# EasyEDA Pro project MSDRv2.eprj, board PCB11
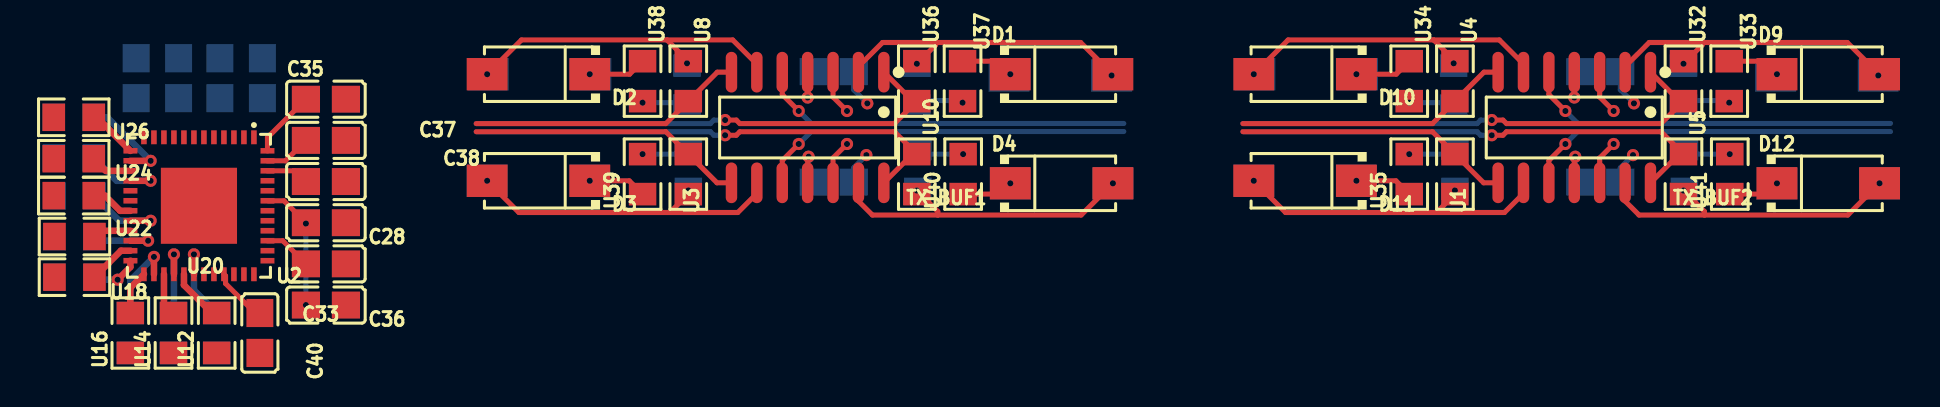
[diagram p16: board, top side]
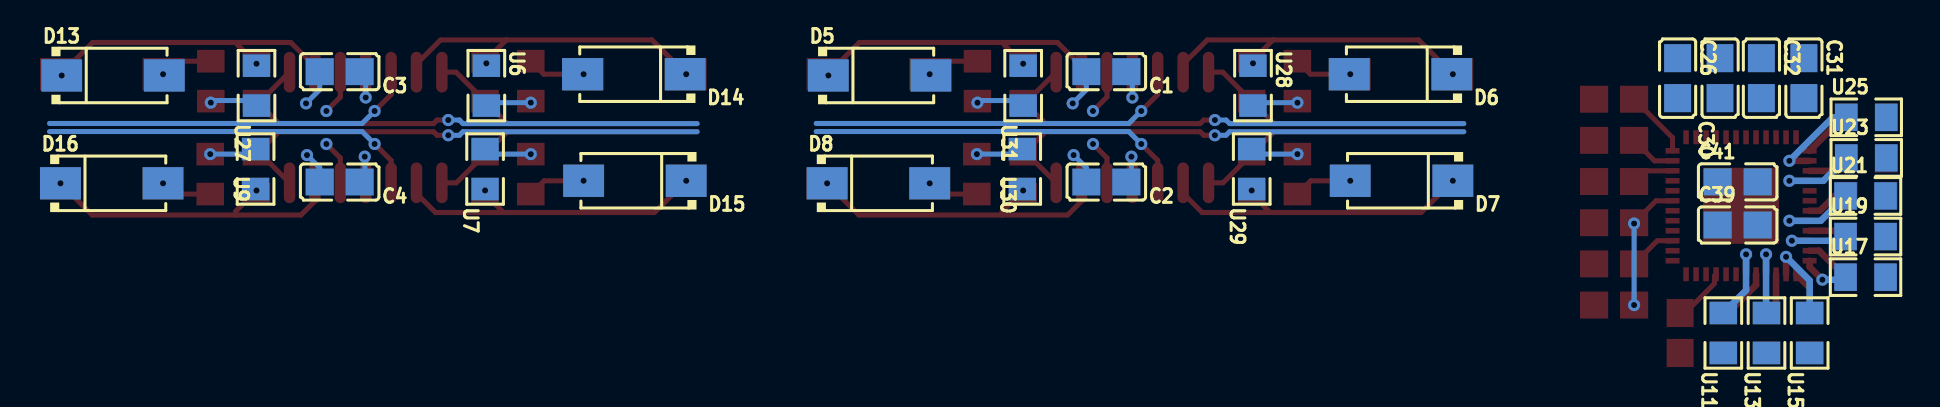
[diagram p17: board, bottom side, seen from below]

No outline. copper layers: Top Layer, Bottom Layer. Coordinates in mm from the lowest, leftmost part position.
Stack: Top Layer 0.035mm / Dielectric1 1.51mm FR4 er 4.5 / Bottom Layer 0.035mm

## Design rules (mm)
template: JLCPCB Capability(Two Layers Board)
spacing copperThickness1oz (default): track to track 0.102, other pairs 0.152 to 0.3
spacing copperThickness2oz: track to track 0.203, other pairs 0.152 to 0.3
track width copperThickness1oz (default): min 0.127, default 0.254, max 2.54
track width copperThickness2oz: min 0.203, default 0.254, max 2.54
differential pair differentialPair (default): width min 0.127, default 0.254, max 2.54; gap min 0.152, default 0.152
via viaSize (default): diameter min 0.5, default 0.61, max 10; hole min 0.3, default 0.305, max 6.3

## Placement (name value [footprint] x y rotation side)
C1  100nF  [C0805]  38 13.08 0 bottom
C2  100nF  [C0805]  38 7.55 0 bottom
C3  100nF  [C0805]  76.34 13.08 0 bottom
C4  100nF  [C0805]  76.34 7.55 0 bottom
C26  330nF  [C0805]  9.43 12.75 270 bottom
C28  100nF  [C0805]  12.61 5.52 180 top
C30  100nF  [C0805]  7.31 12.75 90 bottom
C31  100nF  [C0805]  3.12 12.75 270 bottom
C32  100nF  [C0805]  5.24 12.75 270 bottom
C33  100nF  [C0805]  12.61 3.46 0 top
C35  330nF  [C0805]  12.61 11.7 0 top
C36  100nF  [C0805]  12.61 1.4 180 top
C37  330nF  [C0805]  12.61 9.64 180 top
C38  100nF  [C0805]  12.61 7.58 180 top
C39  100nF  [C0805]  6.43 5.4 180 bottom
C40  100nF  [C0805]  9.31 0 90 top
C41  100nF  [C0805]  6.43 7.56 180 bottom
D1  -  [SMA_L4.4-W2.8-LS5.4-RD]  49.4 12.95 0 top
D2  -  [SMA_L4.4-W2.8-LS5.4-RD]  23.24 12.95 180 top
D3  -  [SMA_L4.4-W2.8-LS5.4-RD]  23.24 7.62 180 top
D4  -  [SMA_L4.4-W2.8-LS5.4-RD]  49.4 7.49 0 top
D5  -  [SMA_L4.4-W2.8-LS5.4-RD]  49.34 12.89 180 bottom
D6  -  [SMA_L4.4-W2.8-LS5.4-RD]  23.29 12.95 0 bottom
D7  -  [SMA_L4.4-W2.8-LS5.4-RD]  23.24 7.62 0 bottom
D8  -  [SMA_L4.4-W2.8-LS5.4-RD]  49.4 7.49 180 bottom
D9  -  [SMA_L4.4-W2.8-LS5.4-RD]  87.74 12.95 0 top
D10  -  [SMA_L4.4-W2.8-LS5.4-RD]  61.58 12.95 180 top
D11  -  [SMA_L4.4-W2.8-LS5.4-RD]  61.58 7.62 180 top
D12  -  [SMA_L4.4-W2.8-LS5.4-RD]  87.74 7.49 0 top
D13  -  [SMA_L4.4-W2.8-LS5.4-RD]  87.68 12.89 180 bottom
D14  -  [SMA_L4.4-W2.8-LS5.4-RD]  61.63 12.95 0 bottom
D15  -  [SMA_L4.4-W2.8-LS5.4-RD]  61.58 7.62 0 bottom
D16  -  [SMA_L4.4-W2.8-LS5.4-RD]  87.74 7.49 180 bottom
TX_BUF1  CLC4601ISO14X  [SOIC-14_L8.7-W3.9-P1.27-LS6.0-BL]  36.7 10.28 180 top
TX_BUF2  CLC4601ISO14X  [SOIC-14_L8.7-W3.9-P1.27-LS6.0-BL]  75.04 10.28 180 top
U1  1120  [R0805]  69.07 7.95 270 top
U2  MAX5864ETM+  [QFN-48_L7.0-W7.0-P0.50-BL-EP5.1]  6.26 6.37 180 top
U3  1120  [R0805]  30.73 7.95 270 top
U4  1120  [R0805]  69.07 12.6 270 top
U5  1120  [R0805]  80.5 7.95 270 top
U6  1120  [R0805]  69.01 12.38 270 bottom
U7  1120  [R0805]  69.07 8.21 90 bottom
U8  1120  [R0805]  30.73 12.6 270 top
U9  1120  [R0805]  80.55 8.21 90 bottom
U10  1120  [R0805]  42.16 7.95 270 top
U11  100  [R0805]  7.15 0 90 bottom
U12  100  [R0805]  7.15 0 90 top
U13  100  [R0805]  4.99 0 90 bottom
U14  100  [R0805]  4.99 0 90 top
U15  100  [R0805]  2.83 0 90 bottom
U16  100  [R0805]  2.83 0 90 top
U17  100  [R0805]  0.04 2.79 180 bottom
U18  100  [R0805]  0.04 2.79 180 top
U19  100  [R0805]  0.04 4.83 180 bottom
U20  100  [R0805]  0.04 4.83 180 top
U21  100  [R0805]  0.04 6.86 180 bottom
U22  100  [R0805]  0 6.88 180 top
U23  100  [R0805]  0 8.76 180 bottom
U24  100  [R0805]  0 8.72 180 top
U25  100  [R0805]  0 10.79 180 bottom
U26  100  [R0805]  0 10.79 180 top
U27  1120  [R0805]  80.5 12.38 90 bottom
U28  1120  [R0805]  30.67 12.38 270 bottom
U29  1120  [R0805]  30.73 8.21 90 bottom
U30  1120  [R0805]  42.21 8.21 90 bottom
U31  1120  [R0805]  42.16 12.38 90 bottom
U32  1120  [R0805]  80.5 12.6 270 top
U33  1120  [R0805]  82.79 12.6 270 top
U34  1120  [R0805]  66.78 12.6 270 top
U35  1120  [R0805]  66.78 7.95 90 top
U36  1120  [R0805]  42.16 12.6 270 top
U37  1120  [R0805]  44.45 12.6 270 top
U38  1120  [R0805]  28.45 12.6 270 top
U39  1120  [R0805]  28.45 7.95 90 top
U40  1120  [R0805]  44.48 7.95 90 top
U41  1120  [R0805]  82.82 7.95 90 top

## Footprints (pads in the part's own frame, mm; a bottom-side part is the same pattern mirrored in y, then rotated)
C0805
  rect 1.41x1.35 smd: 1(-1,0) 2(1,0)
QFN-48_L7.0-W7.0-P0.50-BL-EP5.1
  rect 0.28x0.7 smd: 1(-2.75,-3.428) 2(-2.25,-3.428) 3(-1.75,-3.428) 4(-1.25,-3.428) 5(-0.75,-3.428) 6(-0.25,-3.428) 7(0.25,-3.428) 8(0.75,-3.428) 9(1.25,-3.428) 10(1.75,-3.428) 11(2.25,-3.428) 12(2.75,-3.428) 25(2.75,3.428) 26(2.25,3.428) 27(1.75,3.428) 28(1.25,3.428) 29(0.75,3.428) 30(0.25,3.428) 31(-0.25,3.428) 32(-0.75,3.428) 33(-1.25,3.428) 34(-1.75,3.428) 35(-2.25,3.428) 36(-2.75,3.428)
  rect 0.7x0.28 smd: 13(3.428,-2.75) 14(3.428,-2.25) 15(3.428,-1.75) 16(3.428,-1.25) 17(3.428,-0.75) 18(3.428,-0.25) 19(3.428,0.25) 20(3.428,0.75) 21(3.428,1.25) 22(3.428,1.75) 23(3.428,2.25) 24(3.428,2.75) 37(-3.428,2.75) 38(-3.428,2.25) 39(-3.428,1.75) 40(-3.428,1.25) 41(-3.428,0.75) 42(-3.428,0.25) 43(-3.428,-0.25) 44(-3.428,-0.75) 45(-3.428,-1.25) 46(-3.428,-1.75) 47(-3.428,-2.25) 48(-3.428,-2.75)
  rect 3.81x3.81 smd: 49(0,0)
R0805
  rect 1.133x1.377 smd: 1(-1,0) 2(1,0)
SMA_L4.4-W2.8-LS5.4-RD
  rect 2.046x1.62 smd: 1(-2.566,0) 2(2.566,0)
SOIC-14_L8.7-W3.9-P1.27-LS6.0-BL
  oval 0.574x2.038 smd: 1(-3.81,-2.769) 2(-2.54,-2.769) 3(-1.27,-2.769) 4(0,-2.769) 5(1.27,-2.769) 6(2.54,-2.769) 7(3.81,-2.769) 8(3.81,2.769) 9(2.54,2.769) 10(1.27,2.769) 11(0,2.769) 12(-1.27,2.769) 13(-2.54,2.769) 14(-3.81,2.769)

## Nets
+5V: C1.1 C3.1 TX_BUF1.4 TX_BUF2.4
-5V: C2.1 C4.1 TX_BUF1.11 TX_BUF2.11
GND: C1.2 C2.2 C3.2 C4.2 C26.1 C28.1 C30.2 C31.1 C32.1 C33.2 C35.2 C36.1 C37.1 C38.1 C39.1 C40.1 C41.1 U2.5 U2.7 U2.12 U2.31 U2.32 U2.37 U2.42 U6.2 U7.2 U9.2 U27.1 U28.2 U29.2 U30.2 U31.1 U33.2 U34.2 U35.2 U37.2 U38.2 U39.2 U40.2 U41.2
VCC: C28.2 C30.1 C31.2 C32.2 C33.1 C36.2 C38.2 C39.2 C40.2 C41.2 U2.2 U2.8 U2.11 U2.18 U2.33 U2.39 U2.43 U2.46
$1I40\$1N1602: C37.2 U2.47
$1I40\$1N1605: U2.30 U11.2
$1I40\$1N1608: U2.29 U12.2
$1I40\$1N1611: U2.28 U13.2
$1I40\$1N1614: U2.27 U14.2
$1I40\$1N1617: U2.26 U15.2
$1I40\$1N1620: U2.25 U16.2
$1I40\$1N1625: U2.24 U17.1
$1I40\$1N1628: U2.23 U18.1
$1I40\$1N1633: U2.21 U20.1
$1I40\$1N1636: U2.20 U21.1
$1I40\$1N1639: U2.19 U22.1
$1I40\$1N1642: U2.16 U23.1
$1I40\$1N1645: U2.15 U24.1
$1I40\$1N1648: U2.14 U25.1
$1I40\$1N1651: U2.13 U26.1
$1I40\$1N1653: C35.1 U2.48
$1I40\$1N1654: C26.2 U2.1
$1I40\$1N1662: U2.22 U19.1
$1I40\BBC_CLK: U2.6
$1I40\BBC_DA0: U26.2
$1I40\BBC_DA1: U25.2
$1I40\BBC_DA2: U24.2
$1I40\BBC_DA3: U23.2
$1I40\BBC_DA4: U22.2
$1I40\BBC_DA5: U21.2
$1I40\BBC_DA6: U20.2
$1I40\BBC_DA7: U19.2
$1I40\BBC_DD0: U18.2
$1I40\BBC_DD1: U17.2
$1I40\BBC_DD2: U16.1
$1I40\BBC_DD3: U15.1
$1I40\BBC_DD4: U14.1
$1I40\BBC_DD5: U13.1
$1I40\BBC_DD6: U12.1
$1I40\BBC_DD7: U11.1
$1I40\CS#: U2.36
$1I40\DIN: U2.34
$1I40\RXIN: U2.4
$1I40\RXIP: U2.3
$1I40\RXQN: U2.9
$1I40\RXQP: U2.10
$1I40\SCLK: U2.35
$1I40\TXIN: U2.44
$1I40\TXIP: U2.45
$1I40\TXQN: U2.40
$1I40\TXQP: U2.41
$1I276\$1N983: D1.1 D5.2 U37.1
$1I276\$1N984: D1.2 D5.1 TX_BUF1.2 U31.2 U36.1
$1I276\$1N985: D2.2 D6.1 TX_BUF1.6 U8.1 U28.1
$1I276\$1N986: D2.1 D6.2 U38.1
$1I276\$1N987: D3.1 D7.2 U39.1
$1I276\$1N988: D3.2 D7.1 TX_BUF1.9 U3.2 U29.1
$1I276\$1N989: D4.2 D8.1 TX_BUF1.13 U10.2 U30.1
$1I276\$1N990: D4.1 D8.2 U40.1
$1I276\IN1: TX_BUF1.12
$1I276\IN2: TX_BUF1.3
$1I276\IN3: TX_BUF1.5
$1I276\IN4: TX_BUF1.10
$1I276\OUT1: TX_BUF1.14 U10.1
$1I276\OUT2: TX_BUF1.1 U36.2
$1I276\OUT3: TX_BUF1.7 U8.2
$1I276\OUT4: TX_BUF1.8 U3.1
$1I322\$1N983: D9.1 D13.2 U33.1
$1I322\$1N984: D9.2 D13.1 TX_BUF2.2 U27.2 U32.1
$1I322\$1N985: D10.2 D14.1 TX_BUF2.6 U4.1 U6.1
$1I322\$1N986: D10.1 D14.2 U34.1
$1I322\$1N987: D11.1 D15.2 U35.1
$1I322\$1N988: D11.2 D15.1 TX_BUF2.9 U1.2 U7.1
$1I322\$1N989: D12.2 D16.1 TX_BUF2.13 U5.2 U9.1
$1I322\$1N990: D12.1 D16.2 U41.1
$1I322\IN1: TX_BUF2.12
$1I322\IN2: TX_BUF2.3
$1I322\IN3: TX_BUF2.5
$1I322\IN4: TX_BUF2.10
$1I322\OUT1: TX_BUF2.14 U5.1
$1I322\OUT2: TX_BUF2.1 U32.2
$1I322\OUT3: TX_BUF2.7 U4.2
$1I322\OUT4: TX_BUF2.8 U1.1

Pads without a net: U2 17 38 49

## Via types
v1: diameter 0.61, hole 0.305, Top Layer to Bottom Layer, 62 vias

## Routing (per net, layer and track width the routed paths; a pad name or vN(x,y) marks a point on that pad's centre or on a via; arc(x,y) is an arc through that point)
+5V: length 5.4
  Top Layer w0.254: TX_BUF2.4 v1(75.04,11.78) ; TX_BUF1.4 v1(36.7,11.78)
  Bottom Layer w0.254: C3.1 75.04,12.78 v1(75.04,11.78) ; v1(36.7,11.78) 36.7,12.78 C1.1
-5V: length 5.4
  Top Layer w0.254: TX_BUF1.11 36.7,8.78 v1(36.75,8.82) ; v1(75.09,8.82) 75.04,8.78 TX_BUF2.11
  Bottom Layer w0.254: C4.1 75.09,7.81 v1(75.09,8.82) ; C2.1 36.75,7.81 v1(36.75,8.82)
GND: length 25.3
  Bottom Layer w0.254: 30.73,8.95 v1(28.45,8.95) ; v1(39.69,11.49) 39,12.17 C1.2 ; C2.2 39,8.27 v1(39.64,8.9) ; v1(77.98,8.9) 77.34,8.27 C4.2 ; v1(66.78,11.53) 68.9,11.53 69.01,11.63 ; 30.67,11.63 30.56,11.53 v1(28.45,11.53) ; v1(82.79,11.53) 82.68,11.63 80.5,11.63 ; 42.16,11.63 44.34,11.63 v1(44.45,11.53) ; C3.2 77.34,12.17 v1(78.02,11.49) ; 42.21,8.95 v1(44.48,8.95) ; 69.07,8.95 v1(66.78,8.95) ; 80.55,8.95 v1(82.82,8.95)
VCC: length 13.9
  Top Layer w0.254: U2.46 11.07,8.12 C38.2 ; C33.1 10.45,4.62 U2.39 ; U2.43 10.51,6.62 C28.2 v1(11.61,5.48) ; U2.33 7.59,2.86 7.59,2.47 9.06,1 C40.2
  Bottom Layer w0.254: v1(11.61,1.4) v1(11.61,5.48)
$1I40\$1N1602: length 2.3
  Top Layer w0.254: U2.47 10.59,8.62 C37.2
$1I40\$1N1605: length 4.4
  Top Layer w0.33: U2.30 v1(6.01,3.94)
  Bottom Layer w0.33: U11.2 6.01,2.14 v1(6.01,3.94)
$1I40\$1N1608: length 2.8
  Top Layer w0.33: U2.29 5.51,2.4 6.91,1 U12.2
$1I40\$1N1611: length 3.9
  Top Layer w0.33: U2.28 v1(5.01,3.94)
  Bottom Layer w0.33: U13.2 5.01,1.02 v1(5.01,3.94)
$1I40\$1N1614: length 2.1
  Top Layer w0.33: U2.27 4.51,1.48 U14.2
$1I40\$1N1617: length 4.2
  Top Layer w0.33: U2.26 v1(4.01,3.81)
  Bottom Layer w0.33: v1(4.01,3.81) 2.83,2.63 U15.2
$1I40\$1N1620: length 2.2
  Top Layer w0.33: U2.25 2.83,2.26 U16.2
$1I40\$1N1625: length 2.4
  Top Layer w0.33: v1(2.19,2.67) 2.83,3.3 U2.24
  Bottom Layer w0.33: U17.1 1.16,2.67 v1(2.19,2.67)
$1I40\$1N1628: length 2.3
  Top Layer w0.33: U18.1 2.36,4.12 U2.23
$1I40\$1N1633: length 1.9
  Top Layer w0.33: U2.21 1.33,5.12 U20.1
$1I40\$1N1636: length 4.3
  Top Layer w0.33: U2.20 v1(3.85,5.62)
  Bottom Layer w0.33: v1(3.85,5.62) 2.28,5.62 U21.1
$1I40\$1N1639: length 2.1
  Top Layer w0.33: U22.1 1.56,6.88 2.32,6.12 U2.19
$1I40\$1N1642: length 4.3
  Top Layer w0.33: U2.16 v1(3.85,7.62)
  Bottom Layer w0.33: U23.1 2.15,7.62 v1(3.85,7.62)
$1I40\$1N1645: length 2.1
  Top Layer w0.33: U2.15 1.6,8.12 U24.1
$1I40\$1N1648: length 4.8
  Top Layer w0.33: U2.14 v1(3.85,8.62)
  Bottom Layer w0.33: v1(3.85,8.62) 1.67,10.79 U25.1
$1I40\$1N1651: length 2.5
  Top Layer w0.33: U2.13 1.15,10.79 U26.1
$1I40\$1N1653: length 3.4
  Top Layer w0.254: U2.48 9.69,9.78 C35.1
$1I40\$1N1662: length 3.7
  Top Layer w0.33: U2.22 v1(3.72,4.62)
  Bottom Layer w0.33: U19.1 1.24,4.62 v1(3.72,4.62)
$1I276\$1N983: length 2.7
  Top Layer w0.254: U37.1 46.18,13.6 v1(46.84,12.95)
$1I276\$1N984: length 15.6
  Top Layer w0.254: v1(42.16,13.48) 43.1,14.41 43.1,14.54 ; 43.1,14.54 40.45,14.54 39.24,13.33 TX_BUF1.2 ; 43.1,14.54 50.35,14.54 51.94,12.95 D1.2
  vias: v1(51.9,12.89)
$1I276\$1N985: length 16.6
  Top Layer w0.254: v1(20.67,12.95) 22.39,14.67 29.67,14.67 ; 29.67,14.67 U8.1 ; 29.67,14.67 32.95,14.67 34.16,13.46 TX_BUF1.6
  vias: v1(30.67,13.5)
$1I276\$1N986: length 2.9
  Top Layer w0.254: U38.1 27.79,12.95 v1(25.8,12.95)
$1I276\$1N987: length 2.9
  Top Layer w0.254: v1(25.8,7.62) 27.78,7.62 U39.1
$1I276\$1N988: length 16.4
  Top Layer w0.254: U3.2 29.81,6.03 ; 29.81,6.03 33.21,6.03 34.16,6.98 TX_BUF1.9 ; 29.81,6.03 22.26,6.03 v1(20.67,7.62)
  vias: v1(30.73,7.13)
$1I276\$1N989: length 16.2
  Top Layer w0.254: 43.21,5.9 39.94,5.9 39.24,6.6 TX_BUF1.13 ; 43.21,5.9 43.21,6.08 v1(42.16,7.13) ; 43.21,5.9 50.38,5.9 v1(51.97,7.49)
$1I276\$1N990: length 2.6
  Top Layer w0.254: v1(46.84,7.49) 46.3,6.95 U40.1
$1I276\IN1: length 2.2
  Top Layer w0.254: TX_BUF1.12 37.97,8.76 v1(38.67,9.46)
$1I276\IN2: length 2.2
  Top Layer w0.254: v1(38.67,11.11) 37.97,11.81 TX_BUF1.3
$1I276\IN3: length 18.8
  Top Layer w0.254: TX_BUF1.5 35.43,11.94 v1(36.26,11.11)
  Bottom Layer w0.254: 52.51,10.49 36.88,10.49 v1(36.26,11.11)
$1I276\IN4: length 18.8
  Top Layer w0.254: v1(36.26,9.46) 35.43,8.63 TX_BUF1.10
  Bottom Layer w0.254: v1(36.26,9.46) 36.88,10.08 52.51,10.08
$1I276\OUT1: length 24.9
  Top Layer w0.254: v1(32.57,9.9) 33.13,9.9 33.31,10.07 41.04,10.07 U10.1 41.95,8.95 TX_BUF1.14
  Bottom Layer w0.254: v1(32.57,9.9) 32.01,9.9 31.84,10.07 20.13,10.07
$1I276\OUT2: length 24.9
  Top Layer w0.254: TX_BUF1.1 41.96,11.6 U36.2 41.04,10.48 33.31,10.48 33.13,10.66 v1(32.57,10.66)
  Bottom Layer w0.254: 20.13,10.48 31.84,10.48 32.01,10.66 v1(32.57,10.66)
$1I276\OUT3: length 13.8
  Top Layer w0.254: 20.13,10.48 29.61,10.48 U8.2 32.18,13.05 TX_BUF1.7
$1I276\OUT4: length 13.8
  Top Layer w0.254: TX_BUF1.8 32.17,7.52 U3.1 29.61,10.07 20.13,10.07
$1I322\$1N983: length 2.7
  Top Layer w0.254: v1(85.17,12.95) 84.52,13.6 U33.1
$1I322\$1N984: length 15.6
  Top Layer w0.254: 81.44,14.54 78.79,14.54 77.58,13.33 TX_BUF2.2 ; 81.44,14.54 81.44,14.41 v1(80.5,13.48) ; 81.44,14.54 88.69,14.54 90.28,12.95 D9.2
  vias: v1(90.24,12.89)
$1I322\$1N985: length 16.6
  Top Layer w0.254: 68.01,14.67 60.73,14.67 v1(59.01,12.95) ; 68.01,14.67 71.29,14.67 72.5,13.46 72.5,13.05 ; 68.01,14.67 U4.1
  vias: v1(69.01,13.5)
$1I322\$1N986: length 2.9
  Top Layer w0.254: v1(64.14,12.95) 66.13,12.95 U34.1
$1I322\$1N987: length 2.9
  Top Layer w0.254: U35.1 66.12,7.62 v1(64.14,7.62)
$1I322\$1N988: length 16.4
  Top Layer w0.254: U1.2 68.15,6.03 ; 68.15,6.03 71.55,6.03 72.5,6.98 72.5,7.52 ; 68.15,6.03 60.6,6.03 v1(59.01,7.62)
  vias: v1(69.07,7.13)
$1I322\$1N989: length 16.2
  Top Layer w0.254: 81.55,5.9 78.28,5.9 77.58,6.6 TX_BUF2.13 ; 81.55,5.9 88.72,5.9 v1(90.31,7.49) ; 81.55,5.9 81.55,6.08 v1(80.5,7.13)
$1I322\$1N990: length 2.6
  Top Layer w0.254: U41.1 84.63,6.95 v1(85.17,7.49)
$1I322\IN1: length 2.2
  Top Layer w0.254: TX_BUF2.12 76.31,8.76 v1(77.01,9.46)
$1I322\IN2: length 2.2
  Top Layer w0.254: TX_BUF2.3 76.31,11.81 v1(77.01,11.11)
$1I322\IN3: length 18.8
  Top Layer w0.254: TX_BUF2.5 73.77,11.94 v1(74.59,11.11)
  Bottom Layer w0.254: 90.85,10.49 75.22,10.49 v1(74.59,11.11)
$1I322\IN4: length 18.8
  Top Layer w0.254: TX_BUF2.10 73.77,8.63 v1(74.59,9.46)
  Bottom Layer w0.254: 90.85,10.08 75.22,10.08 v1(74.59,9.46)
$1I322\OUT1: length 24.9
  Top Layer w0.254: v1(70.91,9.9) 71.47,9.9 71.65,10.07 79.38,10.07 U5.1 80.28,8.95 TX_BUF2.14
  Bottom Layer w0.254: 58.47,10.07 70.18,10.07 70.35,9.9 v1(70.91,9.9)
$1I322\OUT2: length 24.9
  Top Layer w0.254: TX_BUF2.1 80.3,11.6 U32.2 79.38,10.48 71.65,10.48 71.47,10.66 v1(70.91,10.66)
  Bottom Layer w0.254: 58.47,10.48 70.18,10.48 70.35,10.66 v1(70.91,10.66)
$1I322\OUT3: length 13.8
  Top Layer w0.254: 58.47,10.48 67.95,10.48 U4.2 70.52,13.05 TX_BUF2.7
$1I322\OUT4: length 13.8
  Top Layer w0.254: TX_BUF2.8 70.51,7.52 U1.1 67.95,10.07 58.47,10.07
